# EAGLE design base-6u-db-power-switch-3x (EAGLE 5.06)
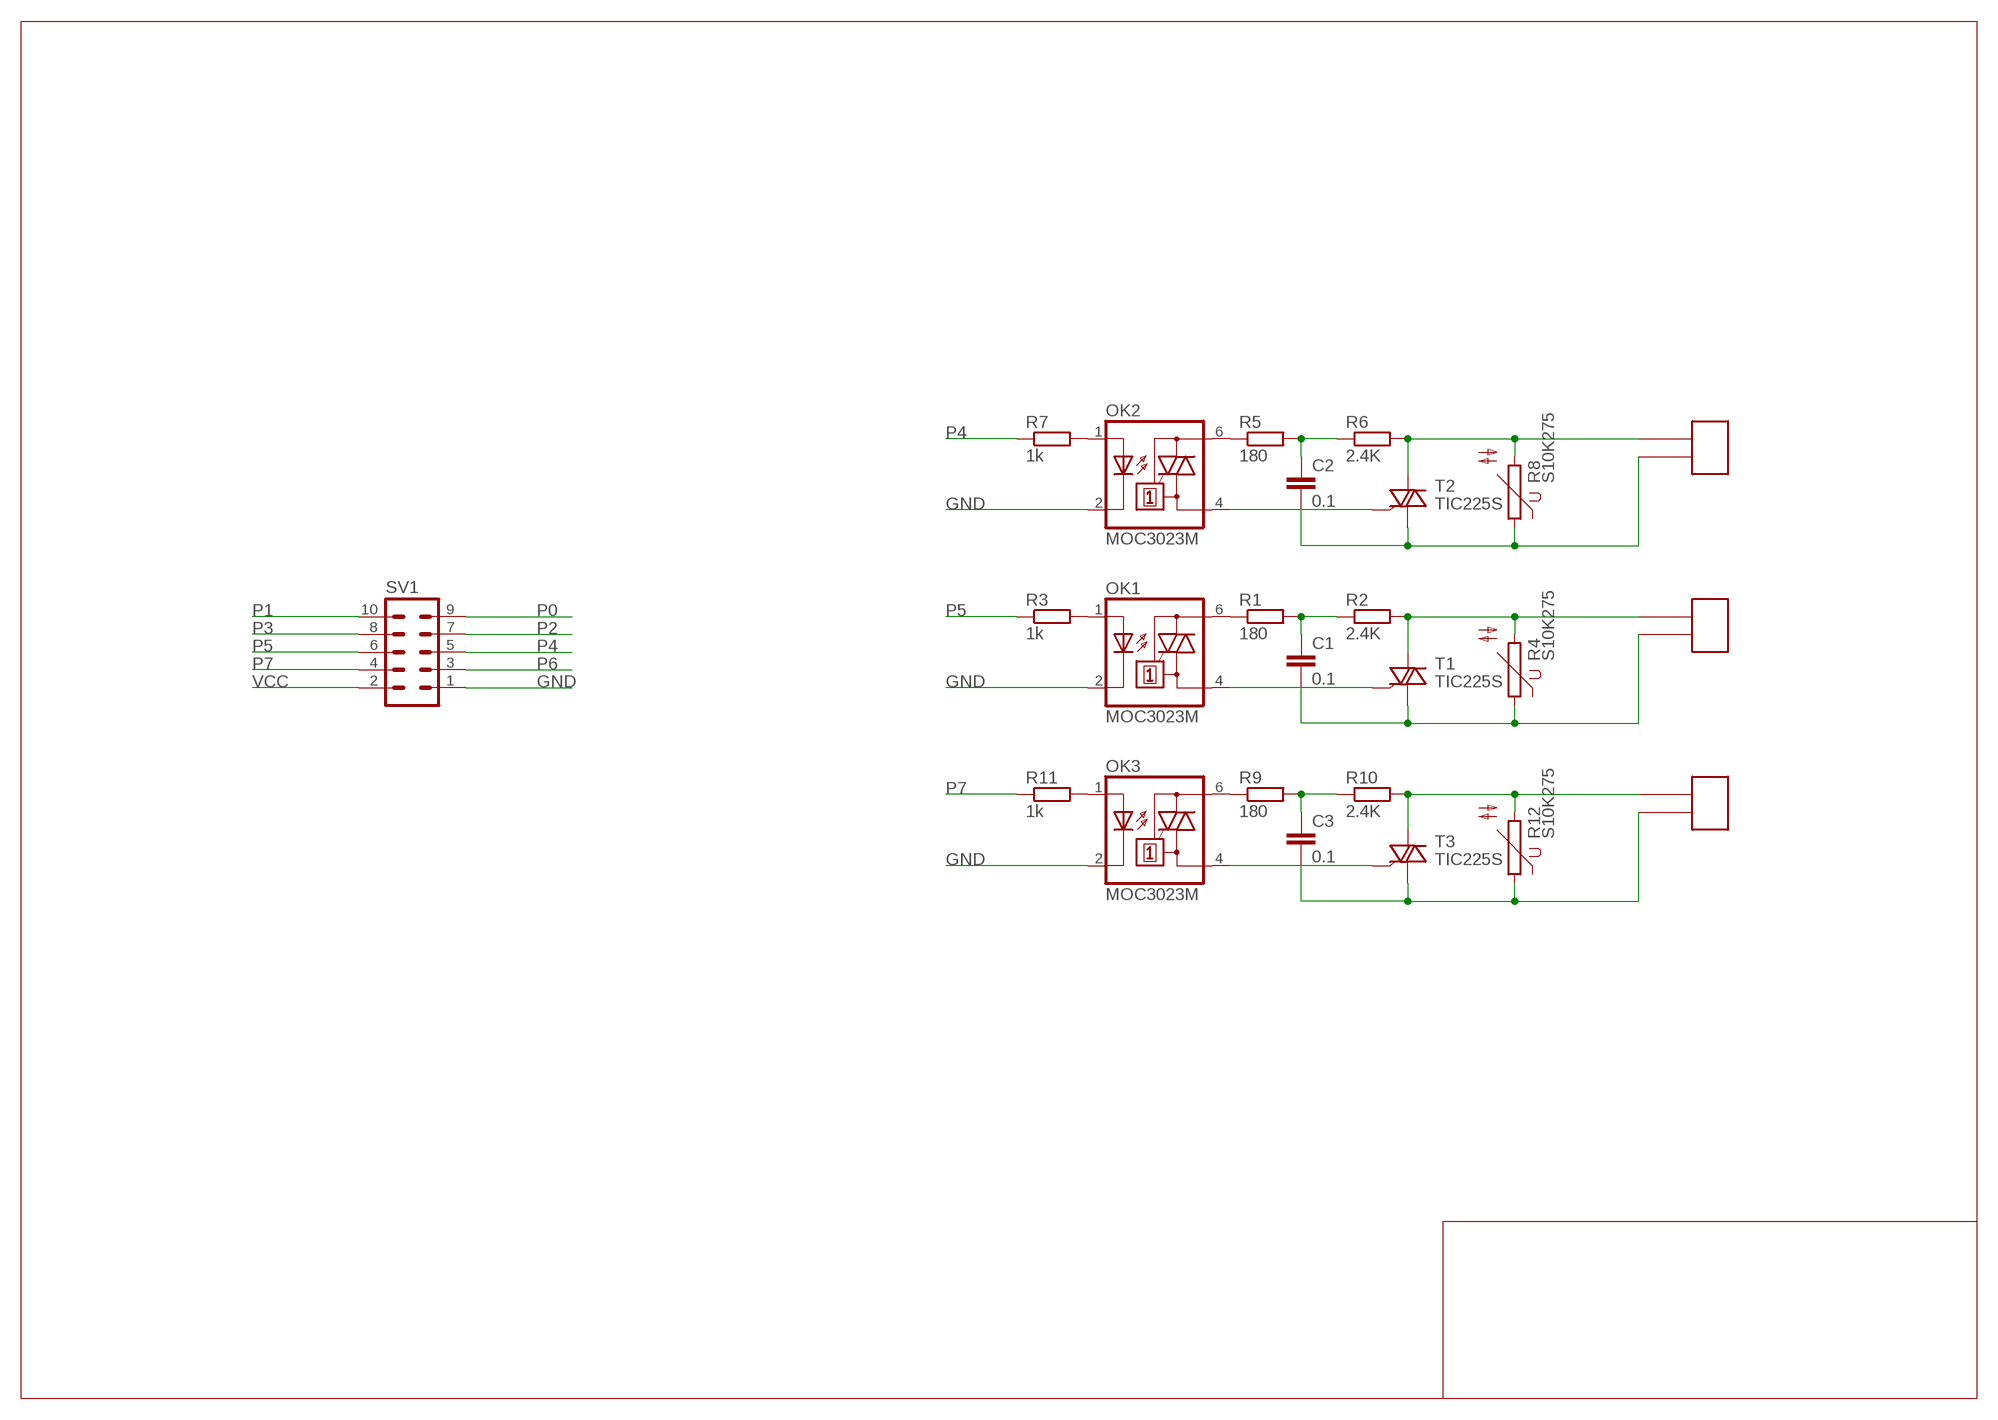
[diagram p0: schematic, sheet 1]

## Parts
C1  0.1  C-EU150-054X183  [C150-054X183]
C2  0.1  C-EU150-054X183  [C150-054X183]
C3  0.1  C-EU150-054X183  [C150-054X183]
OK1  MOC3023M  [DIL06]
OK2  MOC3023M  [DIL06]
OK3  MOC3023M  [DIL06]
R1  180  R-EU_0207/2V  [0207/2V]
R2  2.4K  R-EU_0207/2V  [0207/2V]
R3  1k  R-EU_0207/2V  [0207/2V]
R4  S10K275  S10K250  [S10K250]
R5  180  R-EU_0207/2V  [0207/2V]
R6  2.4K  R-EU_0207/2V  [0207/2V]
R7  1k  R-EU_0207/2V  [0207/2V]
R8  S10K275  S10K250  [S10K250]
R9  180  R-EU_0207/2V  [0207/2V]
R10  2.4K  R-EU_0207/2V  [0207/2V]
R11  1k  R-EU_0207/2V  [0207/2V]
R12  S10K275  S10K250  [S10K250]
SV1  MA05-2  [MA05-2]
T1  TIC225S  [TO220DS]
T2  TIC225S  [TO220DS]
T3  TIC225S  [TO220DS]
U$1  MA02-1  [MA02-1]
U$2  MA02-1  [MA02-1]
U$3  MA02-1  [MA02-1]

## Nets
GND: OK1.2(C) OK2.2(C) OK3.2(C) SV1.1
N$1: OK1.6(A2) R1.1
N$2: C1.1 R1.2 R2.1
N$3: OK1.1(A) R3.2
N$4: OK1.4(A1) T1.G
N$5: C1.2 R4.1 T1.A1 U$1.P2
N$6: OK2.6(A2) R5.1
N$7: R2.2 R4.2 T1.A2 U$1.P1
N$8: OK2.1(A) R7.2
N$9: OK2.4(A1) T2.G
N$10: C2.1 R5.2 R6.1
N$11: R6.2 R8.2 T2.A2 U$2.P1
N$12: C2.2 R8.1 T2.A1 U$2.P2
N$13: OK3.6(A2) R9.1
N$14: OK3.1(A) R11.2
N$15: OK3.4(A1) T3.G
N$16: C3.1 R9.2 R10.1
N$17: R10.2 R12.2 T3.A2 U$3.P1
N$18: C3.2 R12.1 T3.A1 U$3.P2
P0: SV1.9
P1: SV1.10
P2: SV1.7
P3: SV1.8
P4: R7.1 SV1.5
P5: R3.1 SV1.6
P6: SV1.3
P7: R11.1 SV1.4
VCC: SV1.2

## Library data of the parts
C1-C3 = rcl:C-EU: CAPACITOR, European symbol
OK1-OK3 = optocoupler:MOC30*M: RANDOM-PHASE OPTOISOLATORS TRIAC DRIVER OUTPUT Source: http://www.fairchildsemi.com MOC3020-M.pdf
R1-R3 R5-R7 R9-R11 = rcl:R-EU_: RESISTOR, European symbol
R4 R8 R12 = varistor:S10K250: VARISTOR
SV1 = con-lstb:MA05-2: PIN HEADER
T1-T3 = triac:TIC225S: TRIAC
U$1-U$3 = my-con:MA02-1

## Net classes
1 thin: width 0.254 mm
2 z: width 0.127 mm

## Board
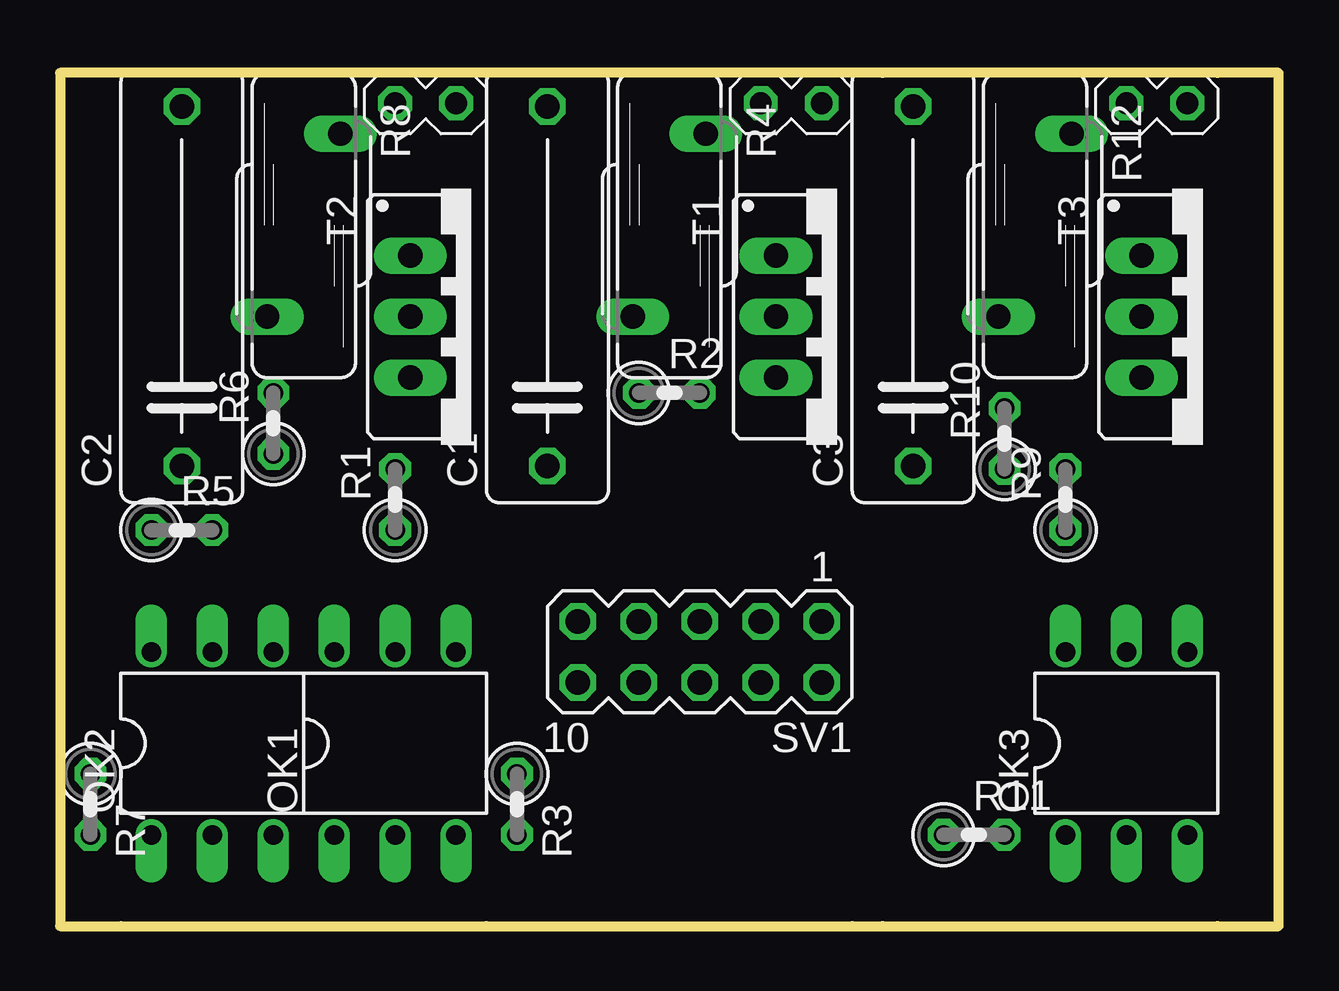
[diagram p1: board, top side]
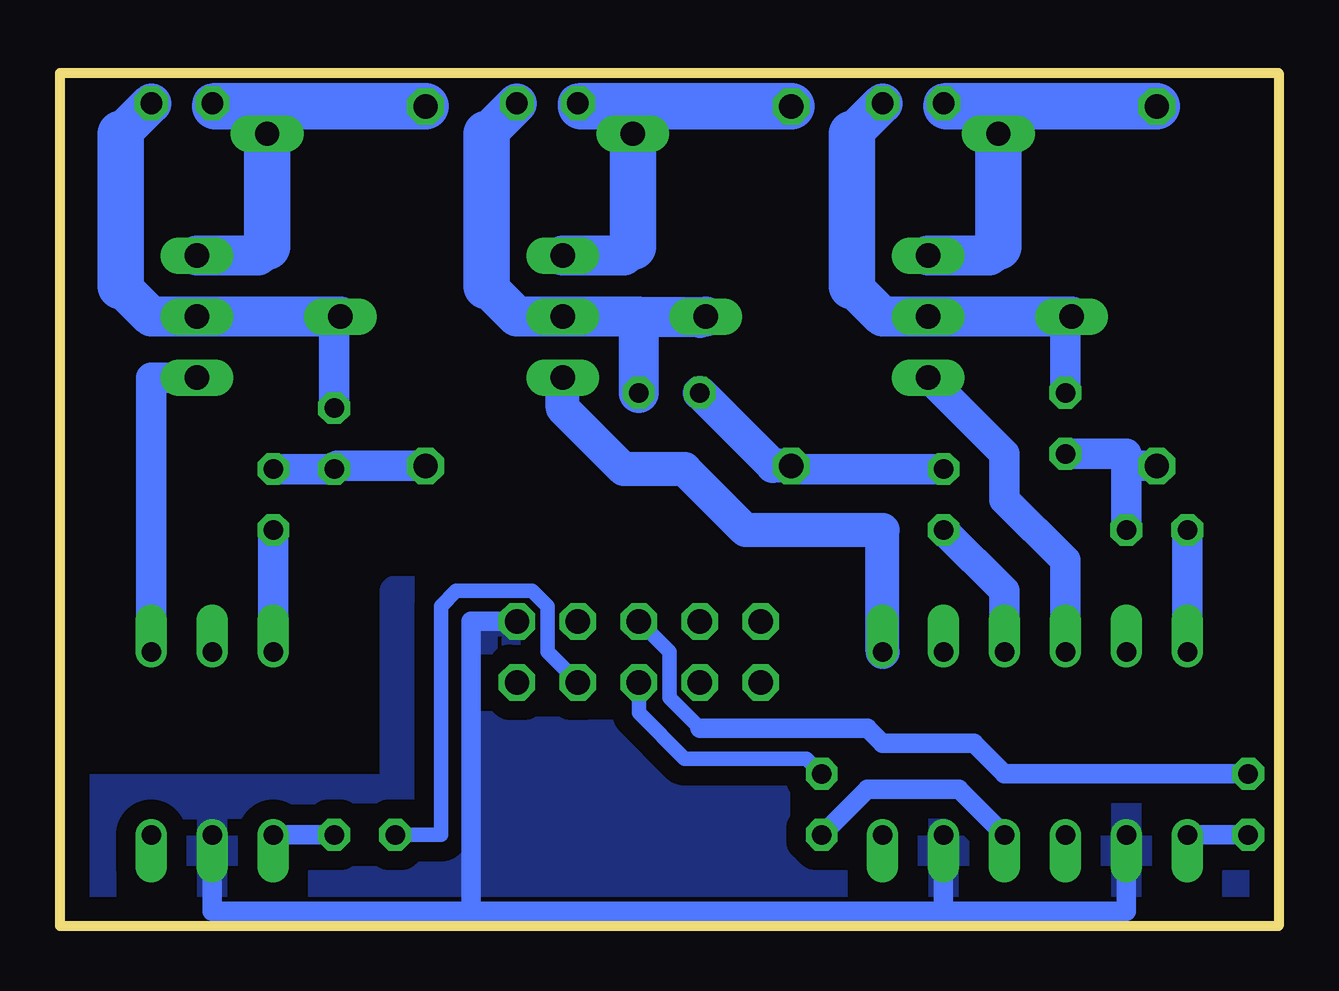
[diagram p2: board, bottom side, seen from below]

Size 50.8 x 35.56 mm. Coordinates in mm from the lower left corner, seen from the top.
Outline: 33.02,0 17.78,0 2.54,0 0,0 0,35.56 2.54,35.56 17.78,35.56 33.02,35.56 34.29,35.56 48.26,35.56 50.8,35.56 50.8,0 48.26,0 33.02,0
Outline: 33.02,0 34.29,0
Copper layers (1*16): Top 0.035mm / dielectric 1.5mm / Bottom 0.035mm
Design rules "default": minimum track width 10mil, minimum drill 24mil, track to track 8mil, track to pad 8mil, pad to pad 8mil, via to via 8mil, smd to smd 8mil, copper to edge 40mil, drill to drill 8mil, minimum pad ring 10mil, minimum via ring 8mil, stop-mask expansion 4mil, vias tented up to drill 0mil, thermal gap 10mil

### Footprints (pad centres in the part's own frame; a part is rotated, then mirrored left to right if it is on the bottom)
C150-054X183 = drill 1.016 octagon: 1 -7.493,0; 2 7.493,0
DIL06 = drill 0.813 offset: 1 -2.54,-3.81; 2 0,-3.81; 3 2.54,-3.81; 4 2.54,3.81; 5 0,3.81; 6 -2.54,3.81
0207/2V = drill 0.813 octagon: 1 -1.27,0; 2 1.27,0
S10K250 = drill 1.016 long: 1 -1.524,-3.81; 2 1.524,3.81
MA05-2 = drill 1.016 octagon: 1 -5.08,-1.27; 2 -5.08,1.27; 3 -2.54,-1.27; 4 -2.54,1.27; 5 0,-1.27; 6 0,1.27; 7 2.54,-1.27; 8 2.54,1.27; 9 5.08,-1.27; 10 5.08,1.27
TO220DS = drill 1.016 long: A1 -2.54,-2.54; A2 0,-2.54; G 2.54,-2.54
MA02-1 = drill 0.9 octagon: P1 -1.27,0; P2 1.27,0

### Placement (x,y rotation side)
C1  20.32,26.67 90 top
C2  5.08,26.67 90 top
C3  35.56,26.67 90 top
OK1  13.97,7.62 0 top
OK2  6.35,7.62 0 top
OK3  44.45,7.62 0 top
R1  13.97,17.78 90 top
R2  25.4,22.23 0 top
R3  19.05,5.08 270 top
R4  25.4,29.21 180 top
R5  5.08,16.51 0 top
R6  8.89,20.95 90 top
R7  1.27,5.08 270 top
R8  10.16,29.21 180 top
R9  41.91,17.78 90 top
R10  39.37,20.32 90 top
R11  38.1,3.81 0 top
R12  40.64,29.21 180 top
SV1  26.67,11.43 180 top
T1  32.38,25.4 270 top
T2  17.14,25.4 270 top
T3  47.62,25.4 270 top
U$1  30.48,34.29 180 top
U$2  15.24,34.29 180 top
U$3  45.72,34.29 180 top

### Tracks (layer width: path | path; a pad name or v marks a point on that pad's centre or on a via)
GND
  Bottom 0.813: 13.97,0.64 OK1.2 | 13.97,0.64 33.66,0.64 | 33.66,0.64 33.66,12.7 SV1.1 | OK2.2 6.35,0.64 13.97,0.64 | OK3.2 44.45,0.64 33.66,0.64
  pour Bottom (isolate 0.813): 0,0 50.8,0 50.8,5.71 36.83,5.71 36.83,13.97 20.32,13.97 20.32,6.35 0,6.35
N$1
  Bottom 1.27: OK1.6 11.43,13.97 R1.1
N$2
  Bottom 1.27: R1.2 20.19,19.05 C1.1
  Bottom 1.422: C1.1 21.08,19.18 R2.1
N$3
  Bottom 0.813: OK1.1 13.34,5.71 17.14,5.71 R3.2
N$4
  Bottom 1.422: OK1.4 16.51,16.51 22.23,16.51 24.77,19.05 27.3,19.05 29.84,21.59 T1.G
N$5
  Bottom 1.676: 29.08,34.16 U$1.P2 | 26.92,28.32 27.3,27.94 T1.A1
  Bottom 1.93: C1.2 26.67,34.16 | 26.67,34.16 29.08,34.16 | 26.67,34.16 26.92,33.91 R4.1 26.92,28.32
N$6
  Bottom 1.27: OK2.6 R5.1
N$7
  Bottom 1.27: R4.2 24.13,25.15
  Bottom 1.676: 26.67,25.4 R4.2 | 26.67,25.4 T1.A2 31.75,25.4 33.02,26.67 | 33.02,33.02 U$1.P1 | R2.2 26.67,25.4
  Bottom 1.93: 33.02,26.67 33.02,33.02
N$8
  Bottom 0.813: R7.2 OK2.1
N$9
  Bottom 1.27: OK2.4 8.89,15.24 11.43,17.78 11.43,19.68 T2.G
N$10
  Bottom 1.27: R6.1 6.35,19.68 6.35,19.05 | R5.2 6.35,19.05 | C2.1 6.22,19.18 6.35,19.05
N$11
  Bottom 1.27: R6.2 8.89,25.15 R8.2
  Bottom 1.676: R8.2 T2.A2 16.51,25.4 17.78,26.67 | 17.78,33.02 U$2.P1
  Bottom 1.93: 17.78,26.67 17.78,33.02
N$12
  Bottom 1.676: 13.84,34.16 U$2.P2 | 11.68,28.32 12.06,27.94 T2.A1
  Bottom 1.93: C2.2 11.43,34.16 | 11.43,34.16 13.84,34.16 | 11.43,34.16 11.68,33.91 R8.1 11.68,28.32
N$13
  Bottom 1.27: OK3.6 R9.1
N$14
  Bottom 0.813: R11.2 OK3.1
N$15
  Bottom 1.27: OK3.4 46.99,22.86 T3.G
N$16
  Bottom 1.27: C3.1 39.24,19.18 R10.1 R9.2
N$17
  Bottom 1.27: R10.2 39.37,25.15 R12.2
  Bottom 1.676: 48.26,26.67 46.99,25.4 T3.A2 R12.2 | 48.26,33.02 U$3.P1
  Bottom 1.93: 48.26,26.67 48.26,33.02
N$18
  Bottom 1.676: 44.32,34.16 U$3.P2 | 42.16,28.32 42.55,27.94 T3.A1
  Bottom 1.93: C3.2 41.91,34.16 | 41.91,34.16 44.32,34.16 | 41.91,34.16 42.16,33.91 R12.1 42.16,28.32
P4
  Bottom 0.61: 24.13,8.26 25.4,9.53 25.4,11.43 SV1.5
  Bottom 0.813: R7.1 11.43,6.35 12.7,7.62 16.51,7.62 17.14,8.26 24.13,8.26
P5
  Bottom 0.61: R3.1 19.68,6.99 24.77,6.99 26.67,8.89 SV1.6
P7
  Bottom 0.61: SV1.4 30.48,11.43 30.48,13.34 31.11,13.97 34.29,13.97 34.92,13.34 34.92,3.81 R11.1